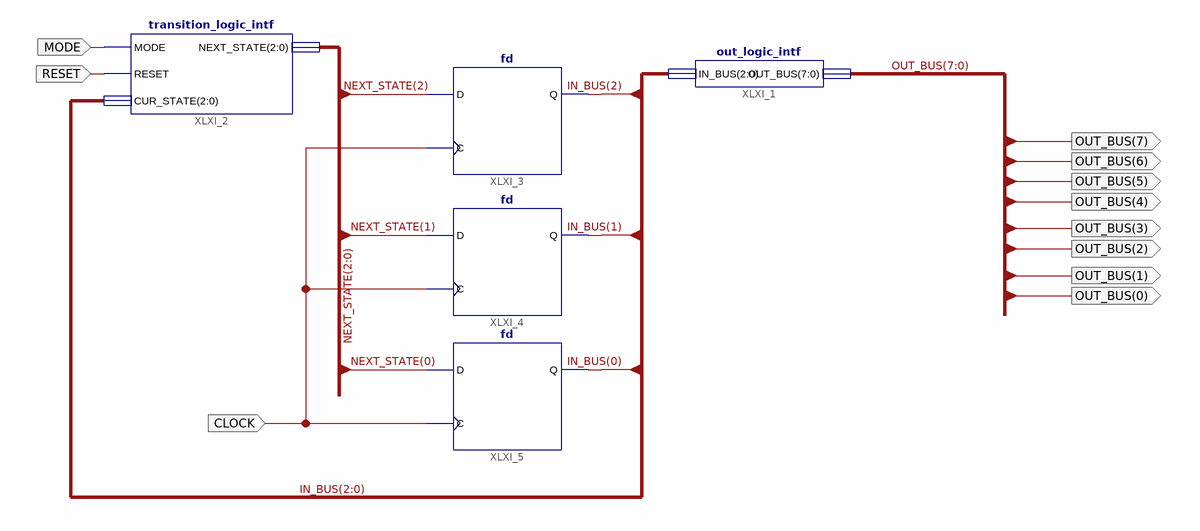
[diagram p0: schematic sheet 1]
// Xilinx ISE schematic LigthController.sch (spartan3a) as structural Verilog: 5 symbols, 11 ports
module LigthController (
  input  MODE,
  input  RESET,
  input  CLOCK,
  output [7:0] OUT_BUS
);

  wire [2:0] IN_BUS, NEXT_STATE;

  out_logic_intf XLXI_1 (.IN_BUS(IN_BUS), .OUT_BUS(OUT_BUS));
  transition_logic_intf XLXI_2 (.MODE(MODE), .RESET(RESET), .CUR_STATE(IN_BUS), .NEXT_STATE(NEXT_STATE));
  fd XLXI_3 (.C(CLOCK), .D(NEXT_STATE[2]), .Q(IN_BUS[2]));
  fd XLXI_4 (.C(CLOCK), .D(NEXT_STATE[1]), .Q(IN_BUS[1]));
  fd XLXI_5 (.C(CLOCK), .D(NEXT_STATE[0]), .Q(IN_BUS[0]));
endmodule
